# Altium project PCB_Project_FlightModel_EPS.PrjPcb (part 4 of 4)

## Sheet 7_dc_dc_3V3_3V3_Deployment_ANT.SchDoc: OBDH Step-Down 3V3/1A/2A
size A4; DrawnBy: Sara V. Martínez; Engineer: Flight; DocumentNumber: 10; Revision: V0.1; SheetNumber: 10; SheetTotal: 11
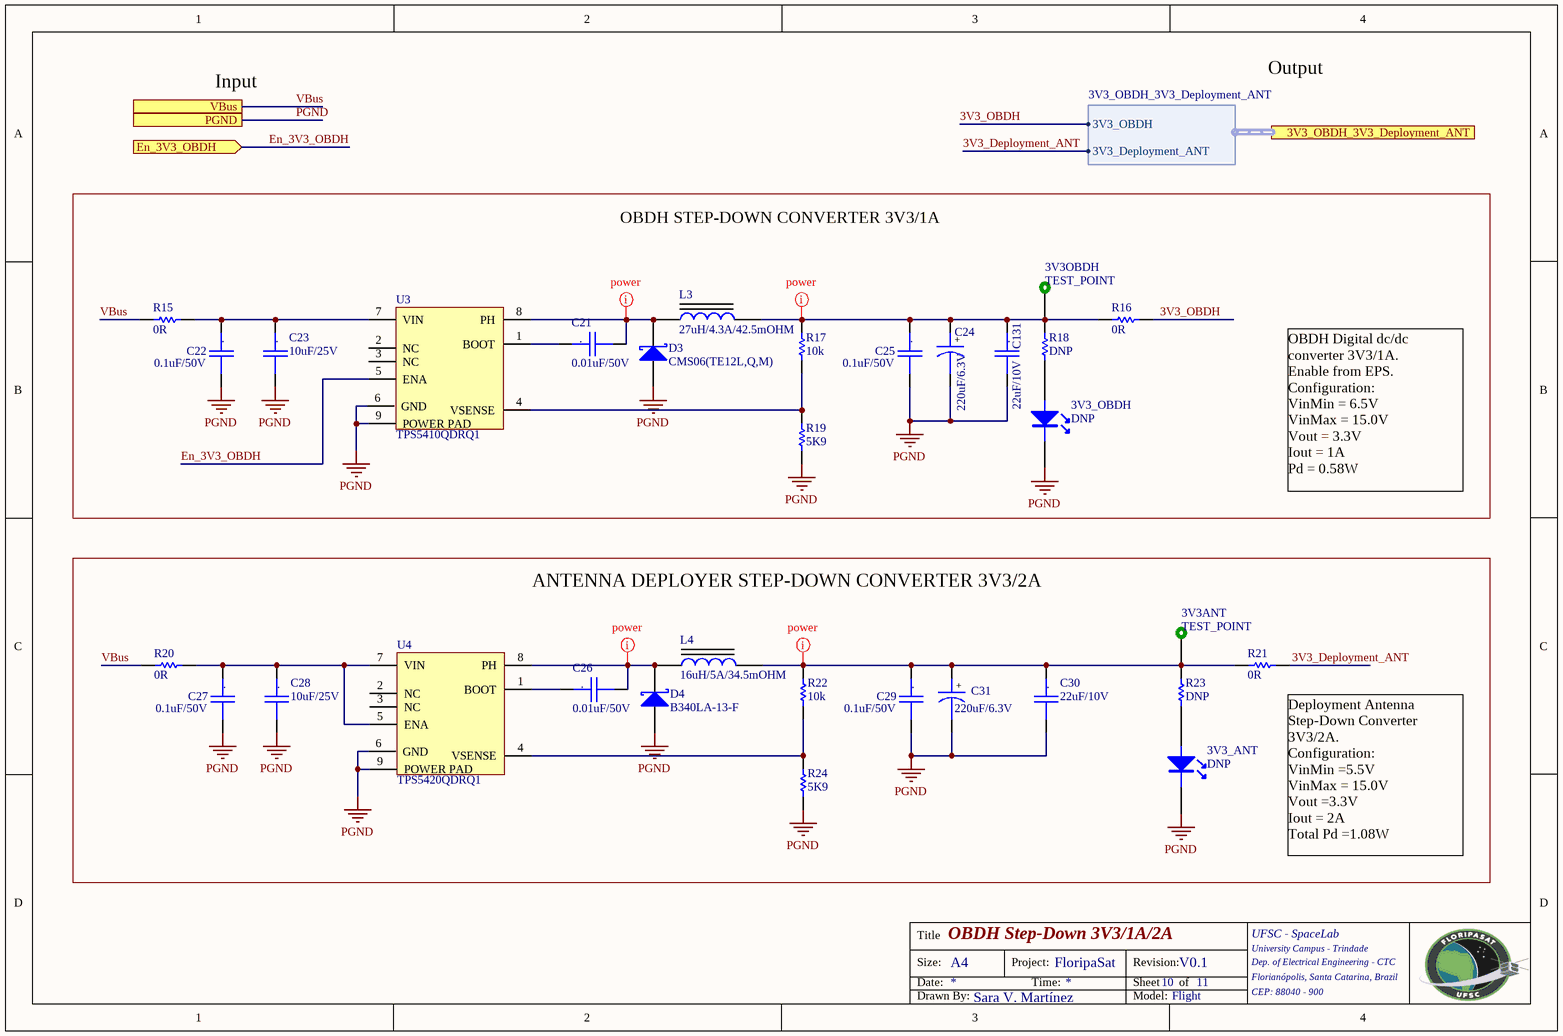
[diagram p7: 7_dc_dc_3V3_3V3_Deployment_ANT.SchDoc]

### Parts
3V3_ANT  DNP  [0603-LED]
3V3_OBDH  DNP  [0603-LED]
3V3ANT  TEST_POINT  [TEST_POINT]  (no BOM)
3V3OBDH  TEST_POINT  [TEST_POINT]  (no BOM)
C21  0.01uF/50V  [CC0805]
C22  0.1uF/50V  [CC0805]
C23  10uF/25V  [CC1206]
C24  220uF/6.3V  [cc1210]
C25  0.1uF/50V  [CC0805]
C26  0.01uF/50V  [CC0805]
C27  0.1uF/50V  [CC0805]
C28  10uF/25V  [CC1206]
C29  0.1uF/50V  [CC0805]
C30  22uF/10V  [CC1206]
C31  220uF/6.3V  [cc1210]
C131  22uF/10V  [CC1206]
D3  CMS06(TE12L,Q,M)  [cms06]
D4  B340LA-13-F  [DO-214AC]
L3  27uH/4.3A/42.5mOHM  [IND_744325xxx]
L4  16uH/5A/34.5mOHM  [IND_744325xxx]
R15  0R  [1206]
R16  0R  [1206]
R17  10k  [0805]
R18  DNP  [0603]
R19  5K9  [0805]
R20  0R  [1206]
R21  0R  [1206]
R22  10k  [0805]
R23  DNP  [0603]
R24  5K9  [0805]
U3  TPS5410QDRQ1  [SO8 Power PAD]
U4  TPS5420QDRQ1  [SO8 Power PAD]

### Blocks framed on the sheet
OBDH STEP-DOWN CONVERTER 3V3/1A: 3V3_OBDH 3V3OBDH C21-C25 C131 D3 L3 R15-R19 U3
ANTENNA DEPLOYER STEP-DOWN CONVERTER 3V3/2A: 3V3_ANT 3V3ANT C26-C31 D4 L4 R20-R24 U4

### Ports
3V3_OBDH_3V3_Deployment_ANT (harness 3V3_OBDH_3V3_Deployment_ANT), En_3V3_OBDH (in), PGND, VBus

### Harnesses
3V3_OBDH_3V3_Deployment_ANT: 3V3_OBDH, 3V3_Deployment_ANT

### Nets
PGND: 3V3_ANT.2(K) 3V3_OBDH.2(K) C22.2 C23.2 C24.2 C25.2 C27.2 C28.2 C29.2 C30.2 C31.2 C131.2 D3.2(A) D4.2(A) R19.1 R24.1 U3.6(GND) U3.9(POWER_PAD) U4.6(GND) U4.9(POWER_PAD) ; port PGND
3V3_Deployment_ANT: R21.1 ; port 3V3_OBDH_3V3_Deployment_ANT.3V3_Deployment_ANT
3V3_OBDH: R16.1 ; port 3V3_OBDH_3V3_Deployment_ANT.3V3_OBDH
En_3V3_OBDH: U3.5(ENA) ; port En_3V3_OBDH
VBus: R15.2 R20.2 ; port VBus
Net3V3_ANT_1: 3V3_ANT.1(A) R23.2
Net3V3_OBDH_1: 3V3_OBDH.1(A) R18.2
Net3V3ANT_1: 3V3ANT.1 C29.1 C30.1 C31.1 L4.2 R21.2 R22.2 R23.1
Net3V3OBDH_1: 3V3OBDH.1 C24.1 C25.1 C131.1 L3.2 R16.2 R17.2 R18.1
NetC21_1: C21.1 U3.1(BOOT)
NetC21_2: C21.2 D3.1(K) L3.1 U3.8(PH)
NetC22_1: C22.1 C23.1 R15.1 U3.7(VIN)
NetC26_1: C26.1 U4.1(BOOT)
NetC26_2: C26.2 D4.1(K) L4.1 U4.8(PH)
NetC27_1: C27.1 C28.1 R20.1 U4.5(ENA) U4.7(VIN)
NetR17_1: R17.1 R19.2 U3.4(VSENSE)
NetR22_1: R22.1 R24.2 U4.4(VSENSE)

Not connected (* = marked no-connect by the designer): U3 2(NC) 3(NC); U4 2(NC) 3(NC)

### Layout directives
net class power: Net3V3ANT_1, Net3V3OBDH_1, NetC21_2, NetC26_2

### Notes on the sheet
- Input
- Output
- OBDH Digital dc/dc converter 3V3/1A.
  Enable from EPS.
  Configuration:
  VinMin = 6.5V
  VinMax = 15.0V
  Vout = 3.3V
  Iout = 1A
  Pd = 0.58W
- (near R21) Deployment Antenna Step-Down Converter 3V3/2A.
  Configuration:
  VinMin =5.5V
  VinMax = 15.0V
  Vout =3.3V
  Iout = 2A
  Total Pd =1.08W
- Title
- Size:
- Date:
- A4
- Project:
- Time:
- FloripaSat
- Revision:
- Sheet
- of
- UFSC - SpaceLab
- University Campus - Trindade
- Dep. of Electrical Engineering - CTC
- Florianópolis, Santa Catarina, Brazil
- Drawn By:
- Model:
- CEP: 88040 - 900
- (in symbol Cap_Cer_X7R_0.01uF_50V_0805) .
- (in symbol Cap_Cer_X7R_0.1uF_50V_0805) .
- (in symbol Cap_Cer_X7R_10uF_25V_1206) .
- (in symbol Cap_Cer_X7R_22uF_10V_1206) .
- (in symbol Cap_Tant_SMD_220uF_6.3V_1210) +

### Library data of the parts
3V3_ANT 3V3_OBDH = LED/G_0603: SMD Green LED; Partnumber: 150060VS75000; NCM: 8541.40.21
3V3ANT 3V3OBDH = TEST_POINT: Test point
C21 C26 = Cap_Cer_X7R_0.01uF_50V_0805: CAP CER 0.01uF 50V 10% X7R 0805; Partnumber: 08055C103KAT4A; NCM: 8532.24.10
C22 C25 C27 C29 = Cap_Cer_X7R_0.1uF_50V_0805: CAP CER 0.1UF 50V 10% X7R 0805; Partnumber: CC0805KRX7R9BB104
C23 C28 = Cap_Cer_X7R_10uF_25V_1206: CAP CER 10uF 25V 10% X7R 1206; Partnumber: GRM31CR71E106KA12L; NCM: 8532.24.10
C24 C31 = Cap_Tant_SMD_220uF_6.3V_1210: CAP Tantalum 220uF 6.3V 20% 1210; Partnumber: 6TPE220MAZB; NCM: 8532.21.11
C30 C131 = Cap_Cer_X7R_22uF_10V_1206: CAP CER 22uF 10V 10% X7R 1206; Partnumber: GRM31CR71A226KE15L; NCM: 8532.24.10
D3 = DIODE_SCHOTTKY_30V_2A_  CMS06(TE12L,Q,M): DIODE SCHOTTKY 30V 2A   CMS06(TE12L,Q,M); NCM: 8541.10.29; Partnumber: CMS06(TE12L,Q,M)
D4 = DIODE_SCHOTTKY_40V_3A_B340LA-13-F: DIODE SCHOTTKY 40V 3A B340LA-13-F; NCM: 8541.10.29; Partnumber: B340LA-13-F
L3 = IND_POWER_27uH_4.3A_42.5mR: INDUCTOR 27UH 4.3A SMD; Partnumber: 7447798271; NCM: 8504.50.00
L4 = IND_POWER_16uH_5A_35.5mR: INDUCTOR 16UH 5A SMD; Partnumber: 7443251600; NCM: 8504.50.00
R15 R16 R20 R21 = R0R_JUMPER_3/4W_1206: RES 0.0 OHM 3/4W JUMP 1206; Partnumber: HCJ1206ZT0R00
R17 R22 = R10k_1%_1/8W_0805: RES 10K OHM 1/8W 1%  0805; Partnumber: CRCW080510K0FKEA; NCM: 8533.21.20
R18 R23 = R1.0k_1%_1/8W_0603: RES 1.0K OHM 1/8W 1% 0603; Partnumber: MCT06030C1001FP500; NCM: 8533.21.20
R19 R24 = R5.9K_1%_1/8W_0805: RES 5K9 OHM 1/8W 1% 0805; Partnumber: 71-CRCW0805-5.9K-E3; NCM: 8533.21.20
U3 = TPS5410QDRQ1: Partnumber: TPS5410QDRQ1
U4 = TPS5420QDRQ1: Partnumber: TPS5420QDRQ1

## Sheet 8_dc_dc_5V_5A_Radio.SchDoc: Radios Step-Down Converters 5V/3A
size A4; DrawnBy: Sara V. Martínez; Engineer: Flight; DocumentNumber: 11; Revision: V0.1; SheetNumber: 11; SheetTotal: 11
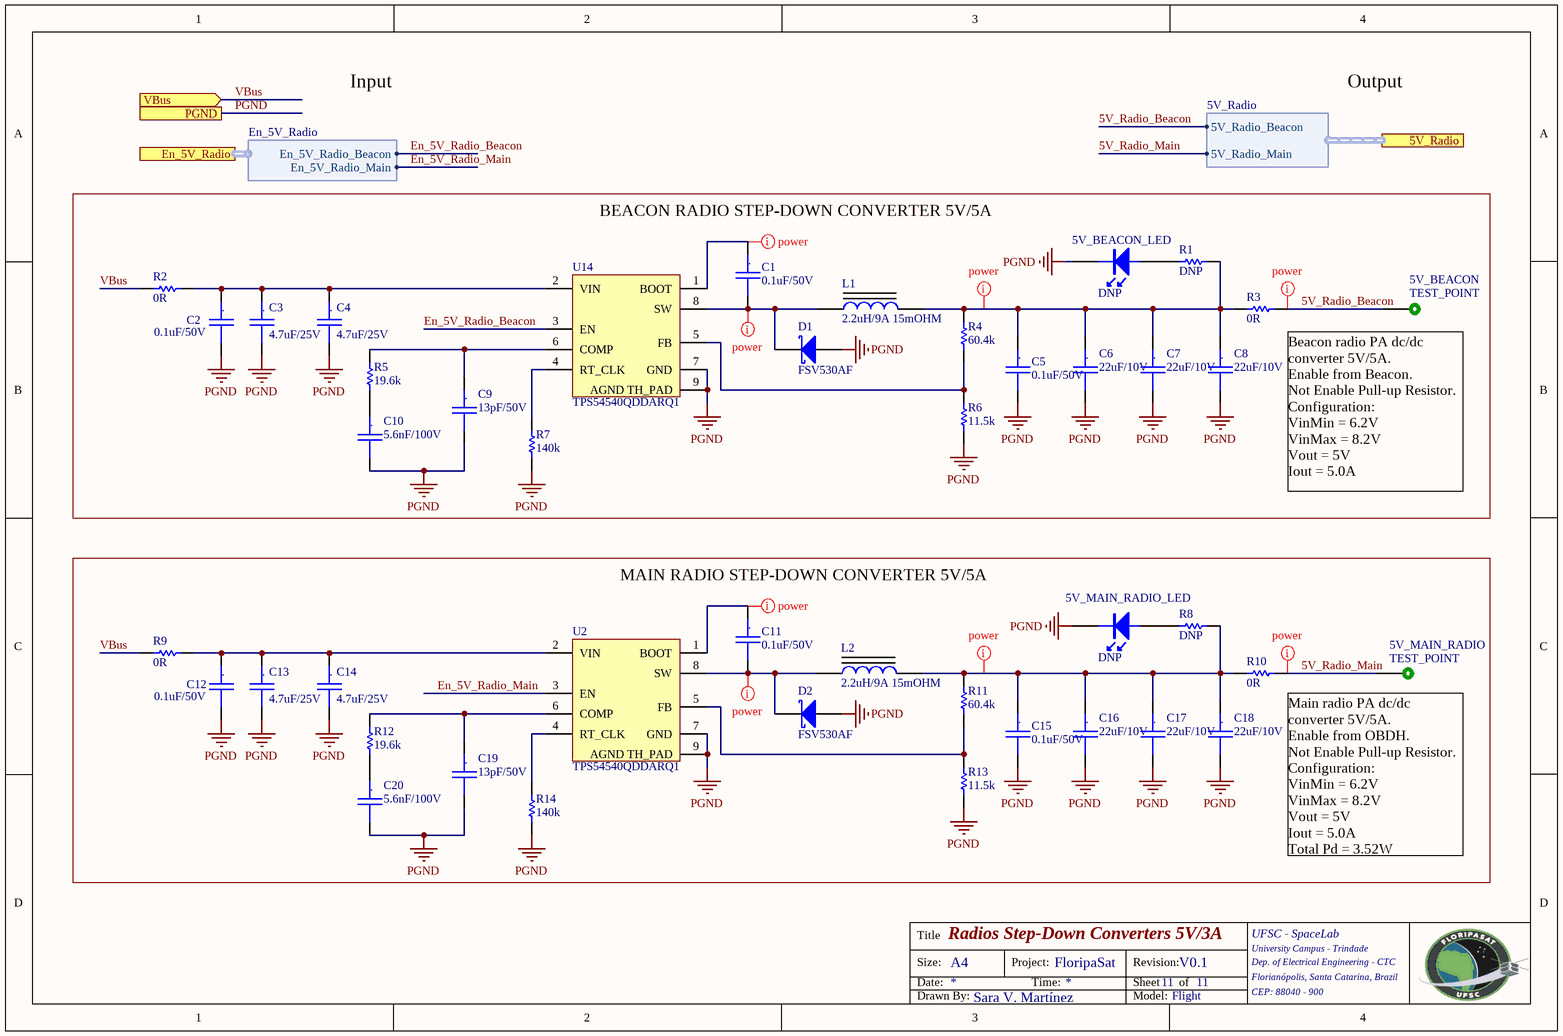
[diagram p8: 8_dc_dc_5V_5A_Radio.SchDoc]

### Parts
5V_BEACON  TEST_POINT  [TEST_POINT]  (no BOM)
5V_BEACON_LED  DNP  [0603-LED]
5V_MAIN_RADIO  TEST_POINT  [TEST_POINT]  (no BOM)
5V_MAIN_RADIO_LED  DNP  [0603-LED]
C1  0.1uF/50V  [CC0805]
C2  0.1uF/50V  [CC0805]
C3  4.7uF/25V  [CC0805]
C4  4.7uF/25V  [CC0805]
C5  0.1uF/50V  [CC0805]
C6  22uF/10V  [CC1206]
C7  22uF/10V  [CC1206]
C8  22uF/10V  [CC1206]
C9  13pF/50V  [CC0603]
C10  5.6nF/100V  [CC0603]
C11  0.1uF/50V  [CC0805]
C12  0.1uF/50V  [CC0805]
C13  4.7uF/25V  [CC0805]
C14  4.7uF/25V  [CC0805]
C15  0.1uF/50V  [CC0805]
C16  22uF/10V  [CC1206]
C17  22uF/10V  [CC1206]
C18  22uF/10V  [CC1206]
C19  13pF/50V  [CC0603]
C20  5.6nF/100V  [CC0603]
D1  FSV530AF  [DO-214AC]
D2  FSV530AF  [DO-214AC]
L1  2.2uH/9A 15mOHM  [Ind_SRP6540]
L2  2.2uH/9A 15mOHM  [Ind_SRP6540]
R1  DNP  [0603]
R2  0R  [1206]
R3  0R  [1206]
R4  60.4k  [0805]
R5  19.6k  [0603]
R6  11.5k  [0805]
R7  140k  [0603]
R8  DNP  [0603]
R9  0R  [1206]
R10  0R  [1206]
R11  60.4k  [0805]
R12  19.6k  [0603]
R13  11.5k  [0805]
R14  140k  [0603]
U2  TPS54540QDDARQ1  [SO8 Power PAD]
U14  TPS54540QDDARQ1  [SO8 Power PAD]

### Blocks framed on the sheet
BEACON RADIO STEP-DOWN CONVERTER 5V/5A: 5V_BEACON 5V_BEACON_LED C1-C10 D1 L1 R1-R7 U14
MAIN RADIO STEP-DOWN CONVERTER 5V/5A: 5V_MAIN_RADIO 5V_MAIN_RADIO_LED C11-C20 D2 L2 R8-R14 U2

### Ports
5V_Radio (harness 5V_Radio), En_5V_Radio (harness En_5V_Radio), PGND, VBus (in)

### Harnesses
5V_Radio: 5V_Radio_Beacon, 5V_Radio_Main
En_5V_Radio: En_5V_Radio_Beacon, En_5V_Radio_Main

### Nets
PGND: 5V_BEACON_LED.2(K) 5V_MAIN_RADIO_LED.2(K) C2.2 C3.2 C4.2 C5.2 C6.2 C7.2 C8.2 C9.2 C10.2 C12.2 C13.2 C14.2 C15.2 C16.2 C17.2 C18.2 C19.2 C20.2 D1.2(A) D2.2(A) R6.1 R7.1 R13.1 R14.1 U2.7(GND) U2.9(AGND_TH_PAD) U14.7(GND) U14.9(AGND_TH_PAD) ; port PGND
5V_Radio_Beacon: 5V_BEACON.1 R3.1 ; port 5V_Radio.5V_Radio_Beacon
5V_Radio_Main: 5V_MAIN_RADIO.1 R10.1 ; port 5V_Radio.5V_Radio_Main
En_5V_Radio_Beacon: U14.3(EN) ; port En_5V_Radio.En_5V_Radio_Beacon
En_5V_Radio_Main: U2.3(EN) ; port En_5V_Radio.En_5V_Radio_Main
VBus: R2.2 R9.2 ; port VBus
Net5V_BEACON_LED_1: 5V_BEACON_LED.1(A) R1.2
Net5V_MAIN_RADIO_LED_1: 5V_MAIN_RADIO_LED.1(A) R8.2
NetC1_1: C1.1 U14.1(BOOT)
NetC1_2: C1.2 D1.1(K) L1.1 U14.8(SW)
NetC2_1: C2.1 C3.1 C4.1 R2.1 U14.2(VIN)
NetC5_1: C5.1 C6.1 C7.1 C8.1 L1.2 R1.1 R3.2 R4.2
NetC9_1: C9.1 R5.2 U14.6(COMP)
NetC10_1: C10.1 R5.1
NetC11_1: C11.1 U2.1(BOOT)
NetC11_2: C11.2 D2.1(K) L2.1 U2.8(SW)
NetC12_1: C12.1 C13.1 C14.1 R9.1 U2.2(VIN)
NetC15_1: C15.1 C16.1 C17.1 C18.1 L2.2 R8.1 R10.2 R11.2
NetC19_1: C19.1 R12.2 U2.6(COMP)
NetC20_1: C20.1 R12.1
NetR4_1: R4.1 R6.2 U14.5(FB)
NetR7_2: R7.2 U14.4(RT_CLK)
NetR11_1: R11.1 R13.2 U2.5(FB)
NetR14_2: R14.2 U2.4(RT_CLK)

### Layout directives
net class power: 5V_Radio_Beacon, 5V_Radio_Main, NetC1_1, NetC1_2, NetC5_1, NetC11_1, NetC11_2, NetC15_1

### Notes on the sheet
- Input
- Output
- Beacon radio PA dc/dc converter 5V/5A.
  Enable from Beacon.
  Not Enable Pull-up Resistor.
  Configuration:
  VinMin = 6.2V
  VinMax = 8.2V
  Vout = 5V
  Iout = 5.0A
  Total Pd = 3.52W
- Main radio PA dc/dc converter 5V/5A.
  Enable from OBDH.
  Not Enable Pull-up Resistor.
  Configuration:
  VinMin = 6.2V
  VinMax = 8.2V
  Vout = 5V
  Iout = 5.0A
  Total Pd = 3.52W
- Title
- Size:
- Date:
- A4
- Project:
- Time:
- FloripaSat
- Revision:
- Sheet
- of
- UFSC - SpaceLab
- University Campus - Trindade
- Dep. of Electrical Engineering - CTC
- Florianópolis, Santa Catarina, Brazil
- Drawn By:
- Model:
- CEP: 88040 - 900
- (in symbol Cap_Cer_C0G_5.6nF_100V_0603) .
- (in symbol Cap_Cer_C0G_13pF_50V_0603) .
- (in symbol Cap_Cer_X7R_0.1uF_50V_0805) .
- (in symbol Cap_Cer_X7R_4.7uF_25V_0805) .
- (in symbol Cap_Cer_X7R_22uF_10V_1206) .

### Library data of the parts
5V_BEACON 5V_MAIN_RADIO = TEST_POINT: Test point
5V_BEACON_LED 5V_MAIN_RADIO_LED = LED/G_0603: SMD Green LED; Partnumber: 150060VS75000; NCM: 8541.40.21
C1 C2 C5 C11 C12 C15 = Cap_Cer_X7R_0.1uF_50V_0805: as C22 on sheet 7_dc_dc_3V3_3V3_Deployment_ANT
C3 C4 C13 C14 = Cap_Cer_X7R_4.7uF_25V_0805: CAP CER 4.7uF 25V 10% X7R 0805; Partnumber: CC0805KKX7R8BB475; NCM: 8532.24.10
C6-C8 C16-C18 = Cap_Cer_X7R_22uF_10V_1206: as C30 on sheet 7_dc_dc_3V3_3V3_Deployment_ANT; NCM: 8532.24.10
C9 C19 = Cap_Cer_C0G_13pF_50V_0603: CAP CER 13PF 50V 0603 NP0; Partnumber: C0603C130J5GAC7867; NCM: 8532.24.10
C10 C20 = Cap_Cer_C0G_5.6nF_100V_0603: CAP CER 5.6nF 100V 0603; Partnumber: C1608C0G2A562J080AE; NCM: 8532.24.10
D1 D2 = DIODE_SCHOTTKY_30V_5A_RB080L-30TE25: DIODE SCHOTTKY 30V 5A DO-214AA; NCM: 8541.10.29; Partnumber: FSV530AF
L1 L2 = IND_POWER_2.2uH_9A_15mR: INDUCTOR 2.2UH 9A SMD; Partnumber: SRP6540-2R2M; NCM: 8504.50.00
R1 R8 = R1.0k_1%_1/8W_0603: as R18 on sheet 7_dc_dc_3V3_3V3_Deployment_ANT; NCM: 8533.21.20
R2 R3 R9 R10 = R0R_JUMPER_3/4W_1206: as R15 on sheet 7_dc_dc_3V3_3V3_Deployment_ANT
R4 R11 = R60.4k_1%_1/8W_0805: RES 60.4k OHM 1/8W 1% 0805; Partnumber: ERJ-6ENF6042V; NCM: 8533.21.20
R5 R12 = R19.6k_1%_1/10W_0603: RES 19.6k OHM 1/10W 1% 0603; Partnumber: ERJ-3EKF1962V; NCM: 8533.21.20
R6 R13 = R11.5k_1%_1/8W_0805: RES 11.5k OHM 1/8W 1% 0805; Partnumber: AC0805FR-0711K5L; NCM: 8533.21.20
R7 R14 = R140k_1%_1/5W_0603: RES 140k OHM 1/5W 1% 0603; Partnumber: ERJ-P03F1403V; NCM: 8533.21.20
U2 U14 = TPS54540QDDARQ1: Partnumber: TPS54540QDDARQ1

## Sheet 2_Battery_Monitoring_And_Switches.SchDoc: Batteries Monitor and Power Switches
size A3; DrawnBy: Sara V. Martínez; Engineer: Flight; DocumentNumber: 5; Revision: V0.1; SheetNumber: 5; SheetTotal: 11
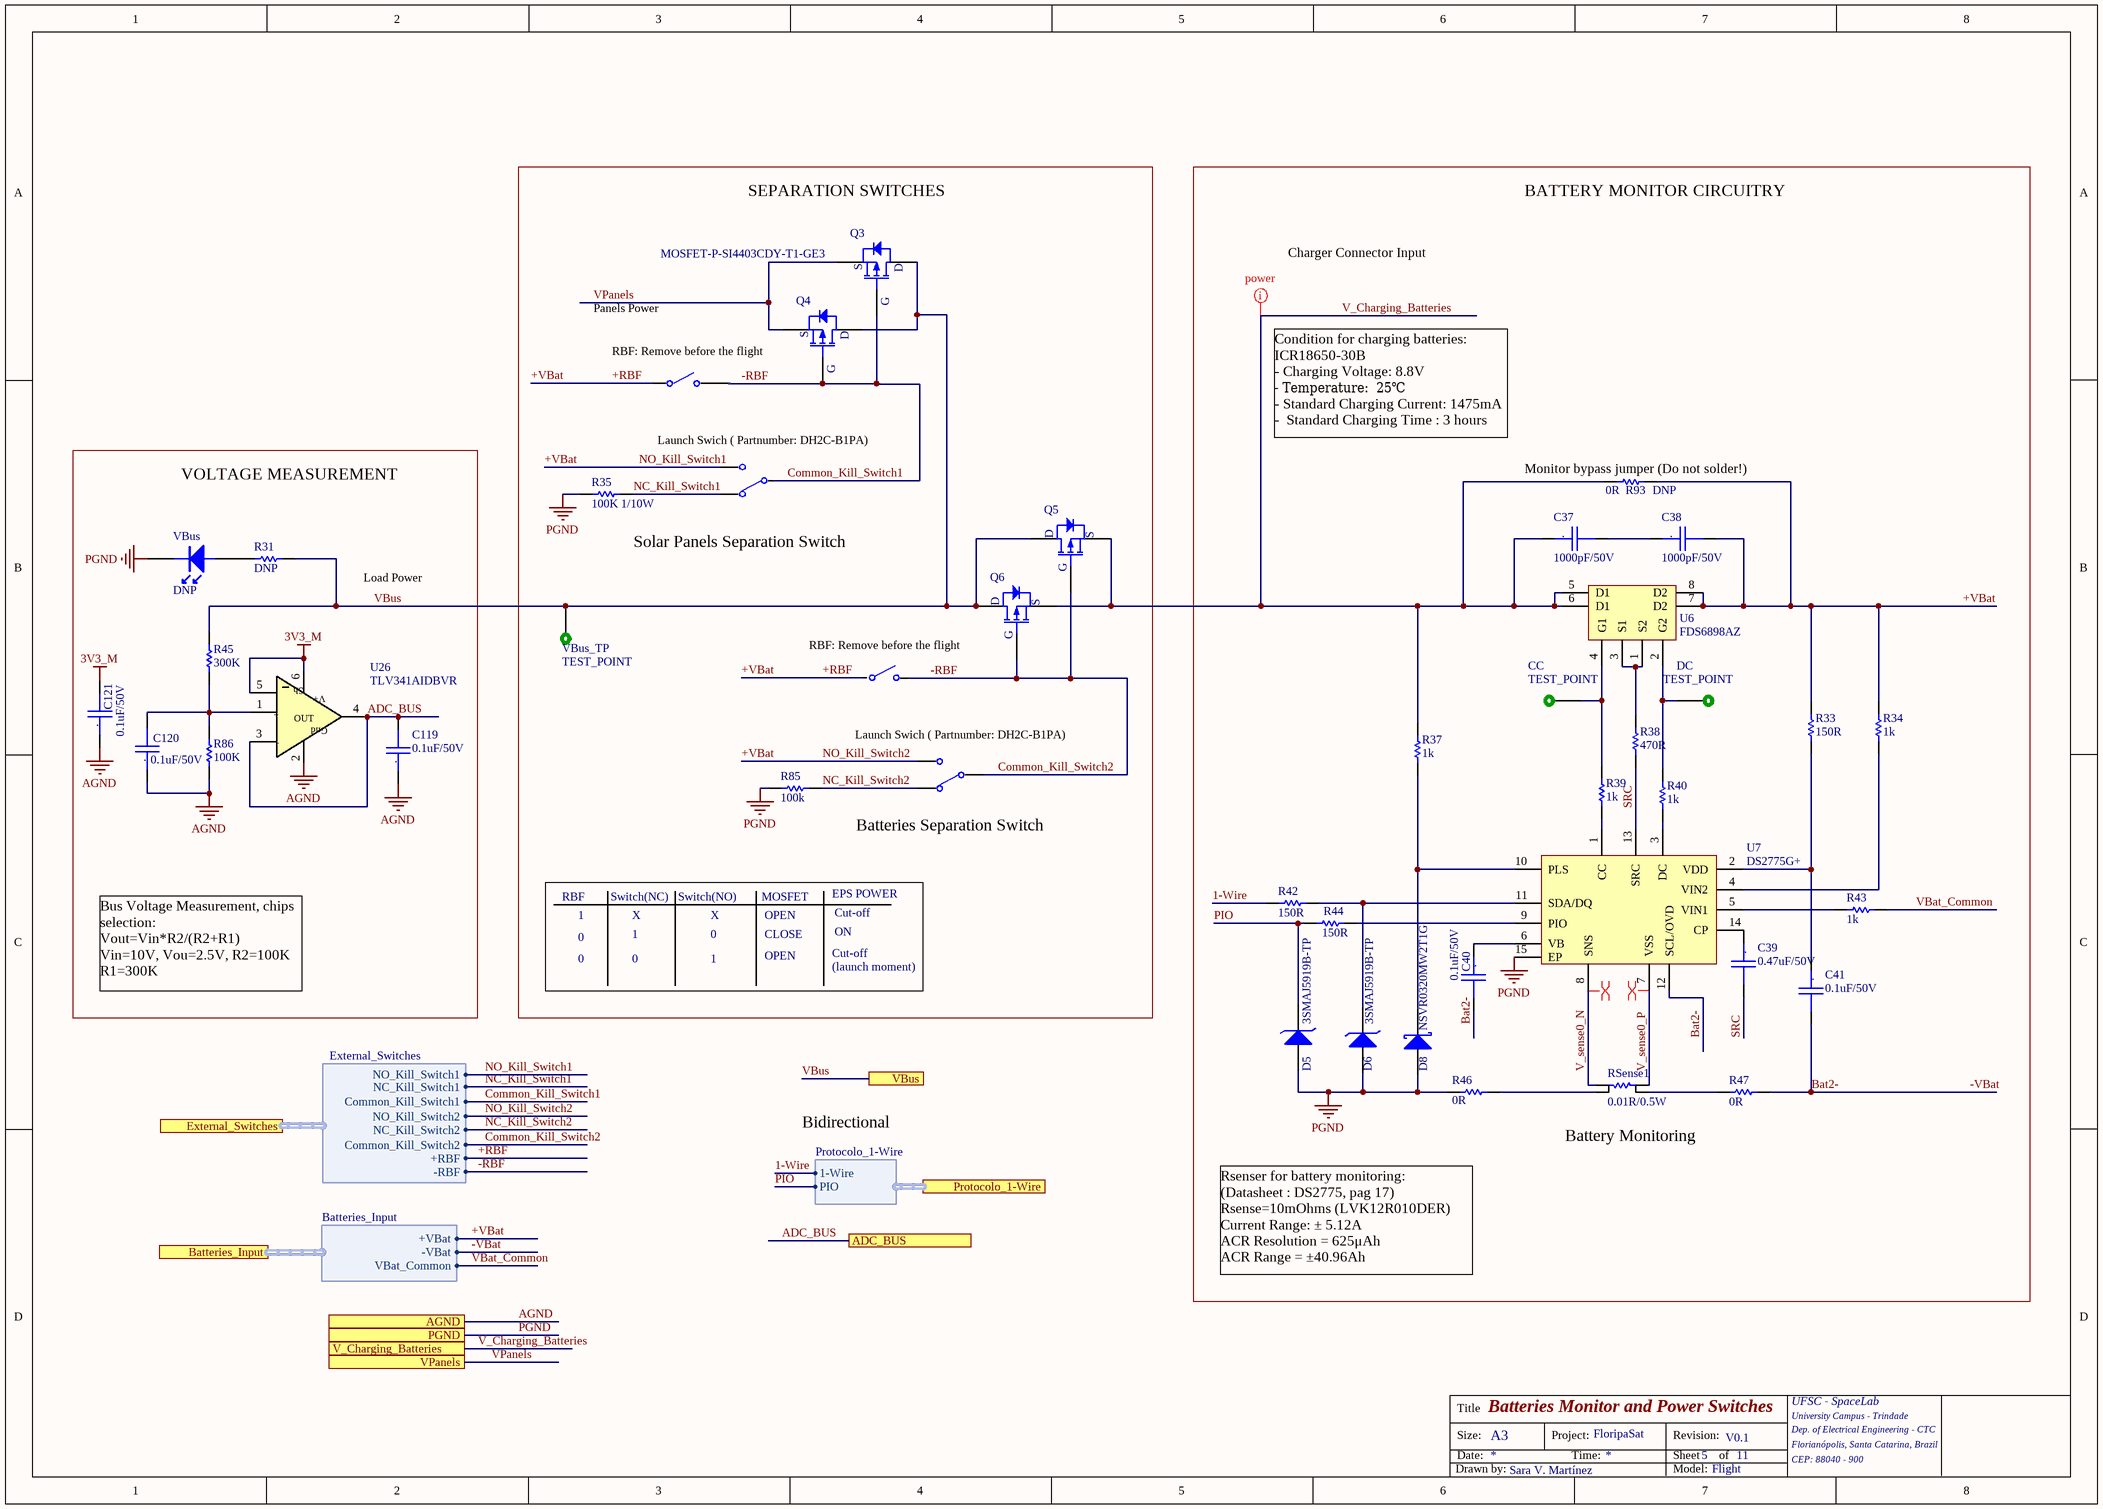
[diagram p9: 2_Battery_Monitoring_And_Switches.SchDoc]

### Parts
C37  1000pF/50V  [CC0603]
C38  1000pF/50V  [CC0603]
C39  0.47uF/50V  [CC0603]
C40  0.1uF/50V  [CC0603]
C41  0.1uF/50V  [CC0603]
C119  0.1uF/50V  [CC0603]
C120  0.1uF/50V  [CC0603]
C121  0.1uF/50V  [CC0603]
CC  TEST_POINT  [TEST_POINT]  (no BOM)
D5  3SMAJ5919B-TP  [DO-214AC]
D6  3SMAJ5919B-TP  [DO-214AC]
D8  NSVR0320MW2T1G  [SOD323F]
DC  TEST_POINT  [TEST_POINT]  (no BOM)
Q3  MOSFET-P-SI4403CDY-T1-GE3  [SOIC8_Mosfet]  (value not drawn)
Q4  MOSFET-P-SI4403CDY-T1-GE3  [SOIC8_Mosfet]
Q5  MOSFET-P-SI4403CDY-T1-GE3  [SOIC8_Mosfet]  (value not drawn)
Q6  MOSFET-P-SI4403CDY-T1-GE3  [SOIC8_Mosfet]  (value not drawn)
R31  DNP  [0603]
R33  150R  [0603]
R34  1k  [0603]
R35  100K 1/10W  [0805]
R37  1k  [0603]
R38  470R  [0603]
R39  1k  [0603]
R40  1k  [0603]
R42  150R  [0603]
R43  1k  [0603]
R44  150R  [0603]
R45  300K  [0603]
R46  0R  [1206]
R47  0R  [1206]
R85  100k  [0805]
R86  100K  [0603]
R93  0R  [1206]
RSense1  0.01R/0.5W  [1206 - ohmite]
U6  FDS6898AZ  [SOIC8]
U7  DS2775G+  [TDFN-14-EP_3x5]
U26  TLV341AIDBVR  [SOT-23 6L]
VBus  DNP  [0603-LED]
VBus_TP  TEST_POINT  [TEST_POINT]  (no BOM)

### Blocks framed on the sheet
VOLTAGE MEASUREMENT: C119-C121 R31 R45 R86 U26 VBus

### Ports
ADC_BUS, AGND, Batteries_Input (harness Batteries_Input), External_Switches (harness External_Switches), PGND, Protocolo_1-Wire (harness Protocolo_1-Wire), V_Charging_Batteries, VBus, VPanels

### Harnesses
Protocolo_1-Wire: 1-Wire, PIO
External_Switches: NO_Kill_Switch1, NC_Kill_Switch1, NO_Kill_Switch2, NC_Kill_Switch2, +RBF, -RBF, Common_Kill_Switch1, Common_Kill_Switch2
Batteries_Input: +VBat, -VBat, VBat_Common

### Nets
3V3_M: C121.2 U26.5(EN) U26.6(V+)
AGND: C119.1 C120.1 C121.1 R86.1 U26.2(Gnd) ; port AGND
PGND: D5.2(A) D6.2(A) D8.2(A) R35.1 R46.2 R85.1 U7.15(EP) VBus.2(K) ; port PGND
1-Wire: R42.2 ; port Protocolo_1-Wire.1-Wire
+RBF: C38.2 R33.1 R34.2 R93.2 U6.7(D2) U6.8(D2) ; port External_Switches.NO_Kill_Switch1, port External_Switches.NO_Kill_Switch2, port External_Switches.+RBF, port Batteries_Input.+VBat  [also labelled +VBat, NO_Kill_Switch1, NO_Kill_Switch2]
-RBF: Q3.2(G) Q4.2(G) Q5.2(G) Q6.2(G) ; port External_Switches.-RBF, port External_Switches.Common_Kill_Switch1, port External_Switches.Common_Kill_Switch2  [also labelled Common_Kill_Switch1, Common_Kill_Switch2]
-VBat: C40.2 C41.2 R47.1 U7.12(SCL/OVD) ; port Batteries_Input.-VBat  [also labelled Bat2-]
ADC_BUS: C119.2 U26.3(-IN) U26.4(OUT) ; port ADC_BUS
NC_Kill_Switch1: R35.2 ; port External_Switches.NC_Kill_Switch1
NC_Kill_Switch2: R85.2 ; port External_Switches.NC_Kill_Switch2
PIO: D5.1(K) R44.2 ; port Protocolo_1-Wire.PIO
SRC: C39.2 R38.1 U7.13(SRC)
V_Charging_Batteries: C37.1 Q5.1(S) Q6.1(S) R37.2 R93.1 U6.5(D1) U6.6(D1) ; port V_Charging_Batteries
V_sense0_N: RSense1.2 U7.8(SNS)
V_sense0_P: RSense1.1 U7.7(VSS)
VBat_Common: R43.1 ; port Batteries_Input.VBat_Common
VBus: Q3.3(D) Q4.3(D) Q5.3(D) Q6.3(D) R31.1 R45.2 VBus_TP.1 ; port VBus
VPanels: Q3.1(S) Q4.1(S) ; port VPanels
NetC37_2: C37.2 C38.1
NetC39_1: C39.1 U7.14(CP)
NetC40_1: C40.1 U7.6(VB)
NetC41_1: C41.1 R33.2 U7.2(VDD)
NetC120_2: C120.2 R45.1 R86.2 U26.1(+IN)
NetCC_1: CC.1 R39.2 U6.4(G1)
NetD6_1: D6.1(K) R42.1 U7.11(SDA/DQ)
NetD8_1: D8.1(K) R37.1 U7.10(PLS)
NetDC_1: DC.1 R40.2 U6.2(G2)
NetR31_2: R31.2 VBus.1(A)
NetR34_1: R34.1 U7.4(VIN2)
NetR38_2: R38.2 U6.1(S2) U6.3(S1)
NetR39_1: R39.1 U7.1(CC)
NetR40_1: R40.1 U7.3(DC)
NetR43_2: R43.2 U7.5(VIN1)
NetR44_1: R44.1 U7.9(PIO)
NetR46_1: R46.1 RSense1.4
NetR47_2: R47.2 RSense1.3

### Layout directives
differential pair: V_sense0_N, V_sense0_P
net class power: V_Charging_Batteries

### Notes on the sheet
- SEPARATION SWITCHES
- BATTERY MONITOR CIRCUITRY
- Panels Power
- Charger Connector Input
- (near Q4) RBF: Remove before the flight
- Launch Swich ( Partnumber: DH2C-B1PA)
- Condition for charging batteries:  ICR18650-30B
  - Charging Voltage: 8.8V
  - Temperature:  25℃
  - Standard Charging Current: 1475mA
  -  Standard Charging Time : 3 hours
- (near R93) Monitor bypass jumper (Do not solder!)
- (near R93) DNP
- Load Power
- (near R35) Solar Panels Separation Switch
- (near Q6) RBF: Remove before the flight
- Batteries Separation Switch
- RBF
- 1
- Switch(NC)
- X
- Switch(NO)
- MOSFET
- OPEN
- EPS POWER
- Cut-off
- Bus Voltage Measurement, chips selection:
  Vout=Vin*R2/(R2+R1)
  Vin=10V, Vou=2.5V, R2=100K
  R1=300K
- 0
- CLOSE
- (launch moment)
- ON
- Bidirectional
- Battery Monitoring
- Rsenser for battery monitoring:
  (Datasheet : DS2775, pag 17)
  Rsense=10mOhms (LVK12R010DER)
  Current Range: ± 5.12A
  ACR Resolution = 625μAh
  ACR Range = ±40.96Ah
- Title
- Size:
- Date:
- A3
- Project:
- Time:
- FloripaSat
- Revision:
- Sheet
- of
- UFSC - SpaceLab
- University Campus - Trindade
- Dep. of Electrical Engineering - CTC
- Florianópolis, Santa Catarina, Brazil
- CEP: 88040 - 900
- Drawn by:
- Model:
- (in symbol Cap_Cer_X7R_0.1uF_50V_0603) .
- (in symbol Cap_Cer_X7R_0.47uF_50V_0603) .
- (in symbol Cap_Cer_X7R_1000pF_50V_0603) .
- (in symbol TLV341AIDBVR) Sh; +; -

### Library data of the parts
C37 C38 = Cap_Cer_X7R_1000pF_50V_0603: CAP CER 1000pF 50V 10% X7R 0603; Partnumber: GRM188R71H102KA01D; NCM: 8532.24.10
C39 = Cap_Cer_X7R_0.47uF_50V_0603: CAP CER 0.47UF 50V 10% X7R 0603; Partnumber: C1608X7R1H474K080AE; NCM: 8532.24.10
C40 C41 C119-C121 = Cap_Cer_X7R_0.1uF_50V_0603: CAP CER 0.1UF 50V 10% X7R 0603; Partnumber: GRM188R71H104KA93D; NCM: 8532.24.10
CC DC VBus_TP = TEST_POINT: Test point
D5 D6 = DIODE_ZENER_5.6V_3SMAJ5919B: DIODE ZENER 5.6V 3W DO214AC; Partnumber: 3SMAJ5919B-TP; NCM: 8541.10.29
D8 = DIODE_SCHOTTKY_23V_1A_NSVR0320MW2T1G: DIODE SCHOTTKY 23V 1A SOD323F; NCM: 8541.10.29; Partnumber: NSVR0320MW2T1G
Q3-Q6 = MOSFET-P- SI4403CDY-T1-GE3: MOSFET 1.8V P-Channel 20 V, 0.0155 Ω typ., 13.4 A; Published: 8-Jun-2000; LatestRevisionDate: 17-Jul-2002; LatestRevisionNote: Re-released for DXP Platform.; PackageVersion: 1995/1996; PackageReference: E3; Publisher: Altium Limited; PackageDescription: TO, Flat Index; 3 In-Line, Axial Leads; Body Dia. 4.6mm; Lead Dia. 0.5 mm (max); Partnumber: SI4403CDY-T1-GE3
R31 R34 R37 R39 R40 R43 = R1.0k_1%_1/8W_0603: as R18 on sheet 7_dc_dc_3V3_3V3_Deployment_ANT; NCM: 8533.21.20
R33 R42 R44 = R150R_1%_1/8W_0603: RES 150R OHM 1/8W 1% 0603; Partnumber: CRCW0603150RFKEA; NCM: 8533.21.20
R35 = R100R_0.1%_1/10W_0805: RES 100K OHM 1/10W 0.1% 0805; Partnumber: CPF-A-0805B100KE; NCM: 8533.21.20
R38 = R470R_1%_1/8W_0603: RES 470R OHM 1/8W 1% 0603; Partnumber: MCT06030C4700FP500; NCM: 8533.21.20
R45 = R300K_0.1%_1/10W_0603: RES 300K OHM 1/10W 0.1% 0603; Partnumber: RG1608P-304-B-T5; NCM: 8533.21.20
R46 R47 R93 = R0R_JUMPER_1/2W_1206: RES 0.0 OHM 1/2W JUMP 1206; Partnumber: CRCW12060000Z0EAHP; NCM: 8533.21.20
R85 = R1.0k_1%_1/8W_0805: RES 100k OHM 1/8W 1% 0805; Partnumber: CPF-A-0805B100KE; NCM: 8533.21.20
R86 = R100K_1%_1/10W_0603: RES 100K OHM 1/10W 1% 0603; Partnumber: CRCW0603100KFKEA; NCM: 8533.21.20
RSense1 = R0.01R_0.5%_0.5W_1206_4_terminal: Current Sense Resistors - SMD 0.01ohm .5% 4 Terminal; Partnumber: LVK12R010DER; NCM: 8533.21.20
U6 = FDS6898AZ: MOSFET 2N-CH 20V 9.4A 8SOIC; Partnumber: FDS6898AZ
U7 = DS2775G+: IC FUEL GAUGE LI+ 2CELL 14-TDFN; Partnumber: DS2775G+
VBus = LED/G_0603: SMD Green LED; Partnumber: 150060VS75000; NCM: 8541.40.21
U26 = TLV341AIDBVR: Partnumber: TLV341AIDBVR

## Sheet 4_Battery_Heater_Controller.SchDoc: Batteries Heater Controller
size A4; DrawnBy: Sara V. Martínez; Engineer: Flight; DocumentNumber: 7; Revision: V0.1; SheetNumber: 7; SheetTotal: 11
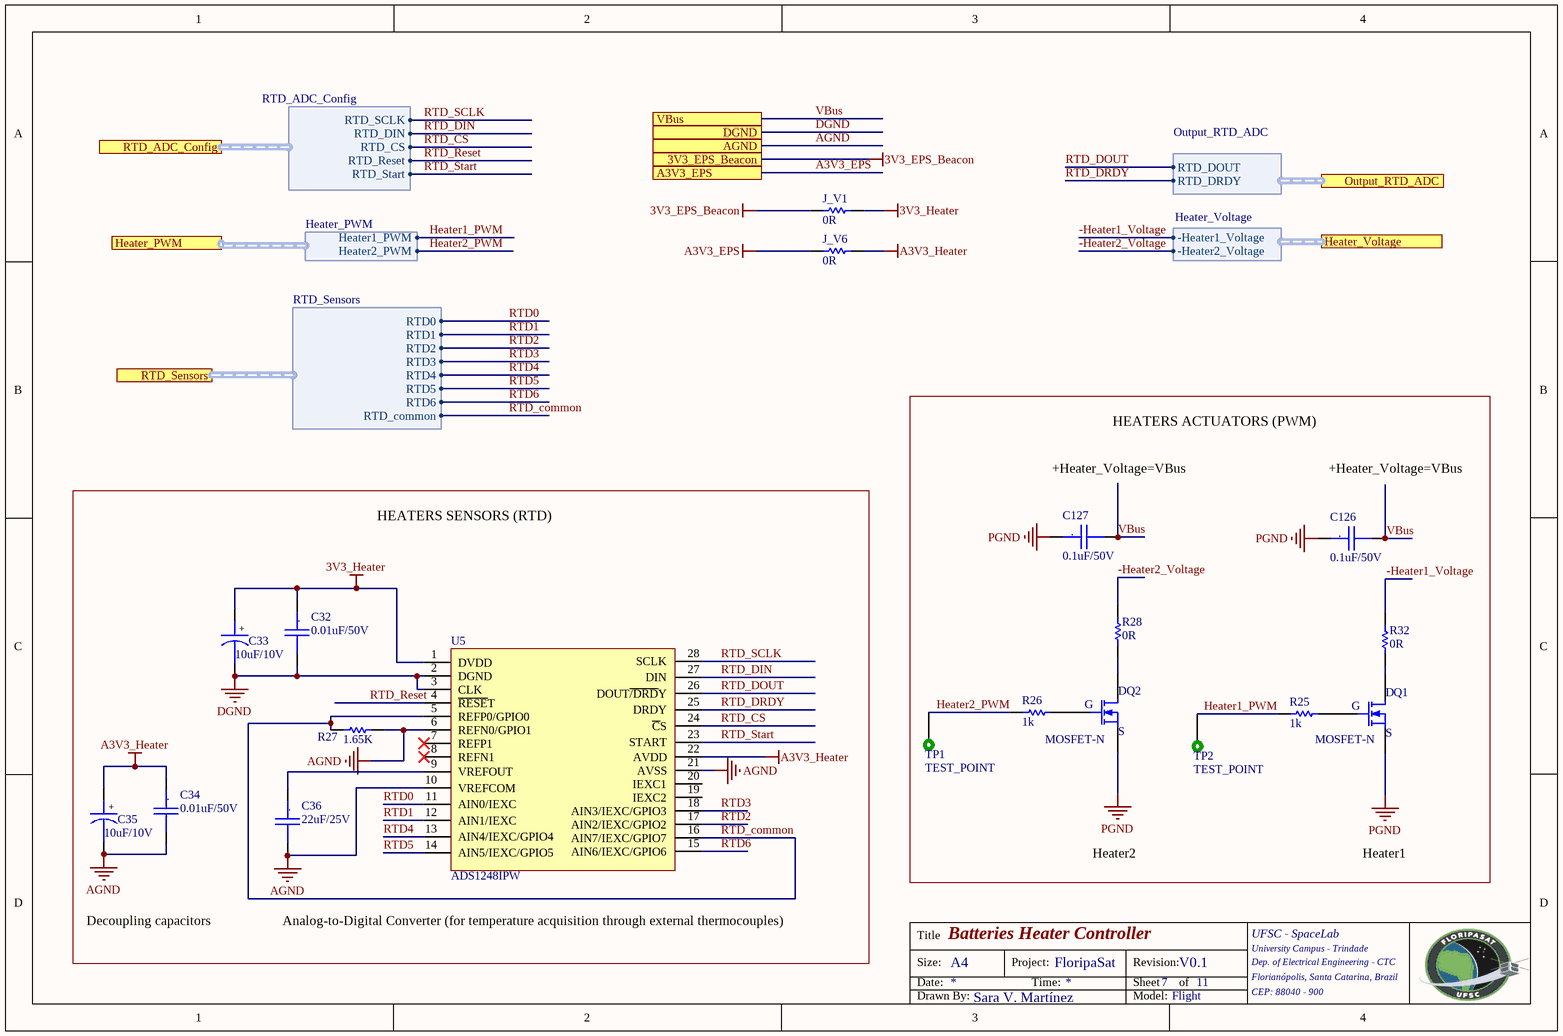
[diagram p10: 4_Battery_Heater_Controller.SchDoc]

### Parts
C32  0.01uF/50V  [CC0805]
C33  10uF/10V  [CC0805_Tantalum]
C34  0.01uF/50V  [CC0805]
C35  10uF/10V  [CC0805_Tantalum]
C36  22uF/25V  [CC1210]
C126  0.1uF/50V  [CC0805]
C127  0.1uF/50V  [CC0805]
J_V1  0R  [0805]
J_V6  0R  [0805]
Q1  MOSFET-N  [SOIC8_Mosfet]
Q2  MOSFET-N  [SOIC8_Mosfet]
R25  1k  [0805]
R26  1k  [0805]
R27  1.65K  [0805]
R28  0R  [0805]
R32  0R  [0805]
TP1  TEST_POINT  [TEST_POINT]  (no BOM)
TP2  TEST_POINT  [TEST_POINT]  (no BOM)
U5  ADS1248IPW  [TSSOP28]

### Blocks framed on the sheet
HEATERS ACTUATORS (PWM): C126 C127 Q1 Q2 R25 R26 R28 R32 TP1 TP2
HEATERS SENSORS (RTD): C32-C36 R27 U5

### Ports
3V3_EPS_Beacon, A3V3_EPS, AGND, DGND, Heater_PWM (harness Heater_PWM), Heater_Voltage (harness Heater_Voltage), Output_RTD_ADC (harness Output_RTD_ADC), RTD_ADC_Config (harness RTD_ADC_Config), RTD_Sensors (harness RTD_Sensors), VBus

### Harnesses
Output_RTD_ADC: RTD_DOUT, RTD_DRDY
RTD_ADC_Config: RTD_SCLK, RTD_DIN, RTD_CS, RTD_Reset, RTD_Start
RTD_Sensors: RTD1, RTD2, RTD3, RTD4, RTD5, RTD6, RTD0, RTD_common
Heater_PWM: Heater1_PWM, Heater2_PWM
Heater_Voltage: -Heater1_Voltage, -Heater2_Voltage

### Nets
3V3_EPS_Beacon: J_V1.2 ; port 3V3_EPS_Beacon
3V3_Heater: C32.1 C33.1 J_V1.1 U5.1(DVDD)
A3V3_EPS: J_V6.2 ; port A3V3_EPS
A3V3_Heater: C34.1 C35.1 J_V6.1 U5.22(AVDD)
AGND: C34.2 C35.2 C36.2 R27.1 U5.6(REFN0/GPIO1) U5.10(VREFCOM) U5.21(AVSS) ; port AGND
DGND: C32.2 C33.2 U5.2(DGND) U5.3(CLK) ; port DGND
PGND: C126.1 C127.1 Q1.1(S) Q2.1(S)
-Heater1_Voltage: R32.1 ; port Heater_Voltage.-Heater1_Voltage
-Heater2_Voltage: R28.1 ; port Heater_Voltage.-Heater2_Voltage
Heater1_PWM: R25.2 TP2.1 ; port Heater_PWM.Heater1_PWM
Heater2_PWM: R26.2 TP1.1 ; port Heater_PWM.Heater2_PWM
RTD0: U5.11(AIN0/IEXC) ; port RTD_Sensors.RTD0
RTD1: U5.12(AIN1/IEXC) ; port RTD_Sensors.RTD1
RTD2: U5.17(AIN2/IEXC/GPIO2) ; port RTD_Sensors.RTD2
RTD3: U5.18(AIN3/IEXC/GPIO3) ; port RTD_Sensors.RTD3
RTD4: U5.13(AIN4/IEXC/GPIO4) ; port RTD_Sensors.RTD4
RTD5: U5.14(AIN5/IEXC/GPIO5) ; port RTD_Sensors.RTD5
RTD6: U5.15(AIN6/IEXC/GPIO6) ; port RTD_Sensors.RTD6
RTD_common: R27.2 U5.5(REFP0/GPIO0) U5.16(AIN7/IEXC/GPIO7) ; port RTD_Sensors.RTD_common
RTD_CS: U5.24(~{C}S) ; port RTD_ADC_Config.RTD_CS
RTD_DIN: U5.27(DIN) ; port RTD_ADC_Config.RTD_DIN
RTD_DOUT: U5.26(DOUT~{/DRD}Y) ; port Output_RTD_ADC.RTD_DOUT
RTD_DRDY: U5.25(DRDY) ; port Output_RTD_ADC.RTD_DRDY
RTD_Reset: U5.4(~{RESE}T) ; port RTD_ADC_Config.RTD_Reset
RTD_SCLK: U5.28(SCLK) ; port RTD_ADC_Config.RTD_SCLK
RTD_Start: U5.23(START) ; port RTD_ADC_Config.RTD_Start
VBus: C126.2 C127.2 ; port VBus
NetC36_1: C36.1 U5.9(VREFOUT)
NetQ1_2: Q1.2(G) R25.1
NetQ1_3: Q1.3(D) R32.2
NetQ2_2: Q2.2(G) R26.1
NetQ2_3: Q2.3(D) R28.2

Not connected (* = marked no-connect by the designer): U5 7(REFP1)* 8(REFN1)* 19(IEXC2) 20(IEXC1)

### Notes on the sheet
- +Heater_Voltage=VBus
- Decoupling capacitors
- Analog-to-Digital Converter (for temperature acquisition through external thermocouples)
- Heater2
- Heater1
- Title
- Size:
- Date:
- A4
- Project:
- Time:
- FloripaSat
- Revision:
- Sheet
- of
- UFSC - SpaceLab
- University Campus - Trindade
- Dep. of Electrical Engineering - CTC
- Florianópolis, Santa Catarina, Brazil
- Drawn By:
- Model:
- CEP: 88040 - 900
- (in symbol Cap_Cer_X7R_0.01uF_16V_1210) .
- (in symbol Cap_Cer_X7R_0.1uF_25V_0805) .
- (in symbol Cap_Cer_X7R_0.01uF_50V_0805) .
- (in symbol Cap_Tant_SMD_10uF_6V3_0805) +

### Library data of the parts
C32 C34 = Cap_Cer_X7R_0.01uF_50V_0805: CAP CER 0.01uF 50V 10% X7R 0805; Partnumber: GRM216R71H103KA01D; NCM: 8532.24.10
C33 C35 = Cap_Tant_SMD_10uF_6V3_0805: CAP Tantalum 10uF 6.3V 10% 0805; Partnumber: TPSR106K006R1000; NCM: 8532.21.11
C36 = Cap_Cer_X7R_0.01uF_16V_1210: CAP CER 22uF 25V 10% X7R 1210; Partnumber: GRM31CR71A226KE15L; NCM: 8532.24.10
C126 C127 = Cap_Cer_X7R_0.1uF_25V_0805: CAP CER 0.1UF 50V 10% X7R 0805; Partnumber: GRM216R71H103KA01D; NCM: 8532.24.10
J_V1 J_V6 R28 R32 = R0R_JUMPER_1/16W_0805: RES 0R OHM 1/16W JUMPER 0805; Partnumber: CRCW08050000Z0EA; NCM: 8533.21.20
Q1 Q2 = MOSFET-N_30V_Si4010DY: MOSFET N-Channel 30V; Partnumber: SI4010DY-T1-GE3; Published: 8-Jun-2000; LatestRevisionDate: 17-Jul-2002; LatestRevisionNote: Re-released for DXP Platform.; PackageVersion: 1995/1996; PackageReference: E3; Publisher: Altium Limited; PackageDescription: TO, Flat Index; 3 In-Line, Axial Leads; Body Dia. 4.6mm; Lead Dia. 0.5 mm (max)
R25 R26 = R1.0k_1%_1/8W_0805: RES 1.0K OHM 1/8W 1% 0805; Partnumber: ERJ-6ENF1001V; NCM: 8533.21.20
R27 = R1.65K_1%_1/10W_0805: RES 1.65K OHM 1/10W 0.1% 0805; Partnumber: PCF0805R-1K65BT1; NCM: 8533.21.20
TP1 TP2 = TEST_POINT: Test point
U5 = ADS1248IPW: 24 bit ADC Differential Input, SPI, 28-pin TSSOP; Manufacturer: Texas Instruments; Part_Number: ADS1248IPWR; Number of Bits: 24; Sampling Rate (Per Second): 2k; Number of Inputs: 4, 7; Input Type: Differential, Single Ended; Configuration: MUX-PGA-ADC; Number of A/D Converters: 1; Architecture: Sigma-Delta; Reference Type: External, Internal; Voltage - Supply, Analog: 2.7 V ~ 5.25 V; Datasheet: *; Supplier: RS Online; Supplier_Link: http://uk.rs-online.com/web/p/general-purpose-adcs/7091921/?searchTerm=ads1248&relevancy-data=636F3D3226696E3D4931384E4B6E6F776E41734D504E266C753D656E266D6D3D6D61746368616C6C7061727469616C26706D3D5E5B5C707B4C7D5C707B4E647D2D2C2F255C2E5D2B2426706F3D313326736E3D592673743D4D414E5F504152545F4E554D4245522677633D424F5448267573743D6164733132343826; Supplier_Part_Number: 709-1921; Price: £7.51; Supplier 1: Digi-Key; Manufacturer Part Number: ADS1248IPW; RoHS: RoHS Compliant; Category: Integrated Circuits (ICs); Stock 1: 1835; Pricing 1: 1=10.49, 10=9.535, 25=8.822, 50=8.3402, 100=8.0994, 250=7.38576, 500=6.91298, 750=6.58295, 1000=5.96079 (EUR); Packaging: Tube; Data Interface: SPI; Ratio - S/H:ADC: -; Voltage - Supply, Digital: 2.7 V ~ 5.25 V; Features: PGA, Temperature Sensor; Operating Temperature: -40°C ~ 105°C; Package / Case: 28-TSSOP (0.173", 4.40mm Width); Supplier Device Package: 28-TSSOP; ComponentLink1URL: http://www.ti.com/lit/ds/symlink/ads1246.pdf; ComponentLink1Description: http://www.ti.com/lit/ds/symlink/ads1246.pdf; Supplier 2: Farnell; Supplier 3: Newark; Supplier Part Number 1: 296-24294-5-ND; Supplier Part Number 2: 1735557; Supplier Part Number 3: 05R0320; partnumber: ADS1248IPWR

## Nets that join several sheets
3V3_EPS_Beacon: EPS_Interface (PC104.H2-27 PC104.H2-28), 3_MCU_EPS (J_V3.2), 5_dc_dc_3V3_EPS_Beacon (3V3EPS.1 C50.1 FB1.1 Rsense3.2), 4_Battery_Heater_Controller (J_V1.2)
3V3_M: 1_Measurement_and_MPPT (37 pins), 5_dc_dc_3V3_EPS_Beacon (C71.2 C130.1 U27.1 U27.6), 2_Battery_Monitoring_And_Switches (C121.2 U26.5 U26.6)
3V3_MCU: EPS_Interface (SBW.1), 3_MCU_EPS (18 pins)
A3V3_EPS: 1_Measurement_and_MPPT (J_V5.2), 3_MCU_EPS (7 pins), 5_dc_dc_3V3_EPS_Beacon (C51.1 FB1.2), 4_Battery_Heater_Controller (J_V6.2)
AGND: 1_Measurement_and_MPPT (56 pins), 3_MCU_EPS (11 pins), 5_dc_dc_3V3_EPS_Beacon (7 pins), 2_Battery_Monitoring_And_Switches (5 pins), 4_Battery_Heater_Controller (7 pins)
DGND: 3_MCU_EPS (22 pins), 4_Battery_Heater_Controller (C32.2 C33.2 U5.2 U5.3)
PGND: EPS_Interface (17 pins), 1_Measurement_and_MPPT (11 pins), 6_dc_dc_5V_Payloads (10 pins), 5_dc_dc_3V3_EPS_Beacon (11 pins), 7_dc_dc_3V3_3V3_Deployment_ANT (20 pins), 8_dc_dc_5V_5A_Radio (30 pins), 2_Battery_Monitoring_And_Switches (8 pins), 4_Battery_Heater_Controller (C126.1 C127.1 Q1.1 Q2.1)
1-Wire: 3_MCU_EPS (R63.2 U12.69), 2_Battery_Monitoring_And_Switches (R42.2)
ADC1_I: 1_Measurement_and_MPPT (C73.1 R67.2 U15.2), 3_MCU_EPS (U12.97)
ADC1_V: 1_Measurement_and_MPPT (C84.2 U17.3 U17.4), 3_MCU_EPS (U12.5)
ADC2_I: 1_Measurement_and_MPPT (C75.1 R68.2 U16.2), 3_MCU_EPS (U12.98)
ADC2_V: 1_Measurement_and_MPPT (C91.2 U21.3 U21.4), 3_MCU_EPS (U12.6)
ADC3_I: 1_Measurement_and_MPPT (C85.1 R72.2 U18.2), 3_MCU_EPS (U12.99)
ADC3_V: 1_Measurement_and_MPPT (C99.2 U24.3 U24.4), 3_MCU_EPS (U12.7)
ADC4_I: 1_Measurement_and_MPPT (C89.1 R75.2 U20.2), 3_MCU_EPS (U12.100)
ADC5_I: 1_Measurement_and_MPPT (C94.1 R79.2 U22.2), 3_MCU_EPS (U12.1)
ADC6_I: 1_Measurement_and_MPPT (C100.1 R83.2 U25.2), 3_MCU_EPS (U12.2)
ADC7_I: 3_MCU_EPS (U12.3), 5_dc_dc_3V3_EPS_Beacon (C129.1 R36.2 U27.2)
ADC_BUS: 3_MCU_EPS (U12.4), 2_Battery_Monitoring_And_Switches (C119.2 U26.3 U26.4)
ADC_TOTAL_V: 1_Measurement_and_MPPT (C87.2 U19.3 U19.4), 3_MCU_EPS (U12.8)
En_3V3_OBDH: 3_MCU_EPS (U12.36), 7_dc_dc_3V3_3V3_Deployment_ANT (U3.5)
En_Payload: 3_MCU_EPS (U12.37), 6_dc_dc_5V_Payloads (U10.5)
Heater1_PWM: 3_MCU_EPS (U12.45), 4_Battery_Heater_Controller (R25.2 TP2.1)
Heater2_PWM: 3_MCU_EPS (U12.44), 4_Battery_Heater_Controller (R26.2 TP1.1)
MPPT_PWM_1: 1_Measurement_and_MPPT (Q8.2 TP6.1), 3_MCU_EPS (U12.51)
MPPT_PWM_2: 1_Measurement_and_MPPT (Q9.2 TP7.1), 3_MCU_EPS (U12.52)
MPPT_PWM_3: 1_Measurement_and_MPPT (Q10.2 TP9.1), 3_MCU_EPS (U12.53)
PIO: 3_MCU_EPS (R64.2 U12.68), 2_Battery_Monitoring_And_Switches (D5.1 R44.2)
RTD_CS: 3_MCU_EPS (U12.65), 4_Battery_Heater_Controller (U5.24)
RTD_DIN: 3_MCU_EPS (U12.60), 4_Battery_Heater_Controller (U5.27)
RTD_DOUT: 3_MCU_EPS (U12.61), 4_Battery_Heater_Controller (U5.26)
RTD_DRDY: 3_MCU_EPS (U12.67), 4_Battery_Heater_Controller (U5.25)
RTD_Reset: 3_MCU_EPS (U12.62), 4_Battery_Heater_Controller (U5.4)
RTD_SCLK: 3_MCU_EPS (U12.59), 4_Battery_Heater_Controller (U5.28)
RTD_Start: 3_MCU_EPS (U12.66), 4_Battery_Heater_Controller (U5.23)
VBus: 6_dc_dc_5V_Payloads (R56.2), 5_dc_dc_3V3_EPS_Beacon (R50.2), 7_dc_dc_3V3_3V3_Deployment_ANT (R15.2 R20.2), 8_dc_dc_5V_5A_Radio (R2.2 R9.2), 2_Battery_Monitoring_And_Switches (7 pins), 4_Battery_Heater_Controller (C126.2 C127.2)
VPanels: 1_Measurement_and_MPPT (13 pins), 2_Battery_Monitoring_And_Switches (Q3.1 Q4.1)

## Assembly variants
Test Model: not fitted 3V3_ANT 3V3_EPS 3V3_MCU 3V3_OBDH 5_V 5V_BEACON_LED 5V_MAIN_RADIO_LED C84 C87 C91 C99 D8 D17 D18 D19 D20 D21 D22 J_V1 J_V3 J_V4 J_V5 J_V6 P11 R2 R3 R9 R10 R15 R16 R20 R21 R46 R47 R50 R51 R55 R56 R65 R66 R87 R88 R89 R90 R91 R93 UART VBus
Flight Model: not fitted R93